# EAGLE design Ctrl_AVR_Reg (EAGLE 5.11)
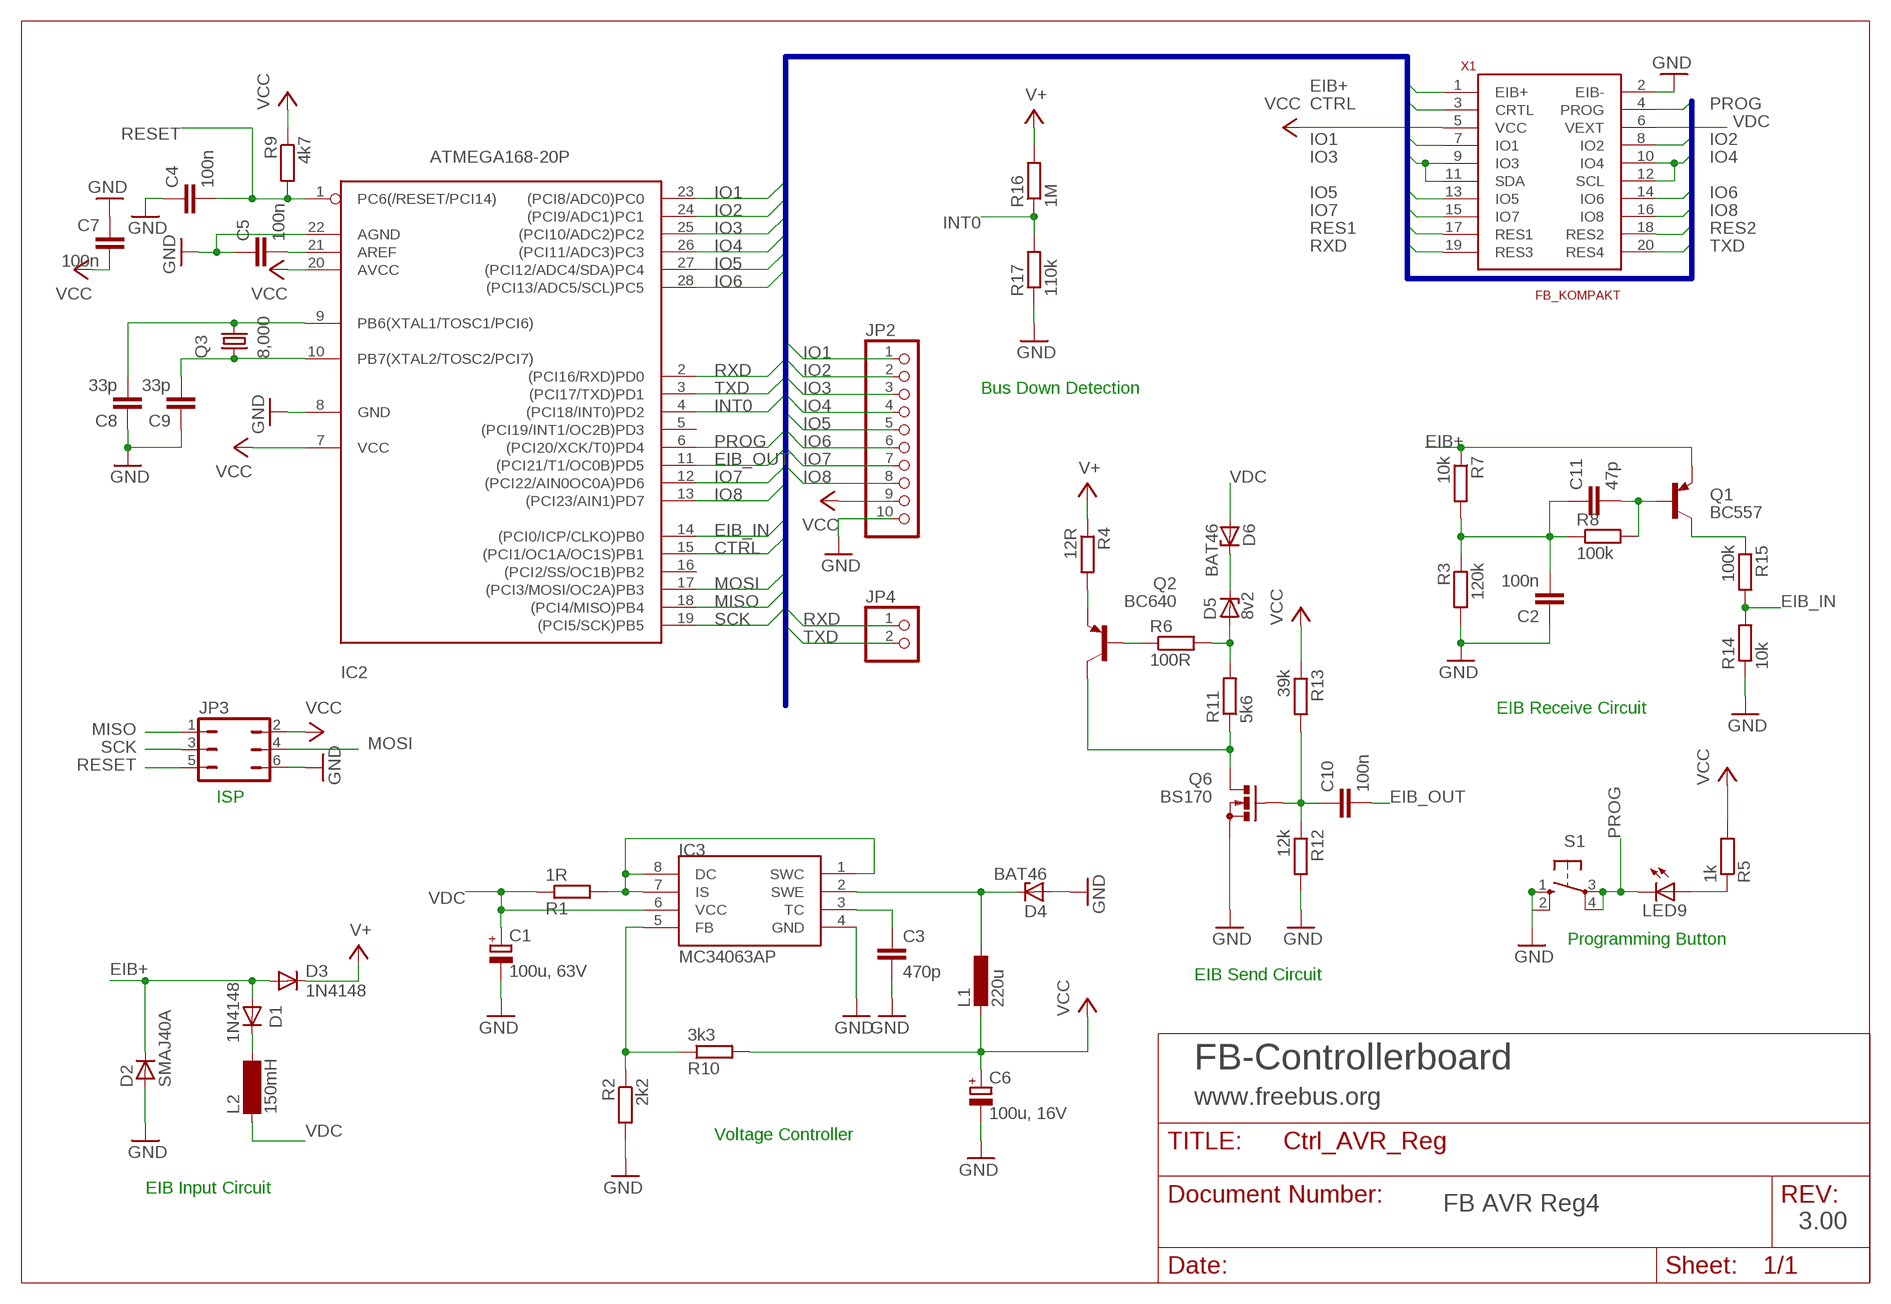
[diagram p0: schematic, sheet 1]

## Parts
C1  100u, 63V  CPOL-EUE5-10.5  [E5-10,5]
C2  100n  C-EU050-024X044  [C050-024X044]
C3  470p  C-EU025-024X044  [C025-024X044]
C4  100n  C-EU050-024X044  [C050-024X044]
C5  100n  C-EUC1206  [C1206]
C6  100u, 16V  CPOL-EUE2.5-7  [E2,5-7]
C7  100n  C-EUC1206  [C1206]
C8  33p  C-EU025-025X050  [C025-025X050]
C9  33p  C-EU025-025X050  [C025-025X050]
C10  100n  C-EU050-024X044  [C050-024X044]
C11  47p  C-EU050-024X044  [C050-024X044]
D1  1N4148  1N4148DO35-10  [DO35-10]
D2  SMAJ40A  D-SMB  [SMB]
D3  1N4148  1N4148DO35-10  [DO35-10]
D4  BAT46  1N821  [DO35Z10]
D5  8v2  BZX90  [DO34Z7]
D6  BAT46  1N821  [DO35Z10]
IC2  ATMEGA168-20P  [DIL28-3]
IC3  MC34063AP  [DIL08]
JP2  PINHD-1X10  [1X10]
JP3  JP3Q  [JP3Q]
JP4  PINHD-1X2  [1X02]
L1  220u  L-EU0207/12  [0207/12]
L2  150mH  SD12-1000  [SD12_1000]
LED9  LED3MM  [LED3MM]
Q1  BC557  [TO92]
Q2  BC640  [TO92-BCE]
Q3  8,000  CRYSTALHC49U-V  [HC49U-V]
Q6  BS170  [SOT54E]
R1  1R  R-EU_0207/10  [0207/10]
R2  2k2  R-EU_0207/10  [0207/10]
R3  120k  R-EU_0207/10  [0207/10]
R4  12R  R-EU_0207/10  [0207/10]
R5  1k  R-EU_0207/10  [0207/10]
R6  100R  R-EU_0207/10  [0207/10]
R7  10k  R-EU_0207/10  [0207/10]
R8  100k  R-EU_0207/10  [0207/10]
R9  4k7  R-EU_0207/10  [0207/10]
R10  3k3  R-EU_0207/10  [0207/10]
R11  5k6  R-EU_0207/10  [0207/10]
R12  12k  R-EU_0207/10  [0207/10]
R13  39k  R-EU_0207/10  [0207/10]
R14  10k  R-EU_0207/10  [0207/10]
R15  100k  R-EU_0207/10  [0207/10]
R16  1M  R-EU_0207/10  [0207/10]
R17  110k  R-EU_0207/10  [0207/10]
S1  10-XX  [B3F-10XX]
X1  FB_KOMPAKT  [ML20]

## Nets
CTRL: IC2.15((PCI1/OC1A/OC1S)PB1) X1.3(CRTL)
EIB+: D1.A D2.1(C) D3.A Q1.1(E) R7.1 X1.1(EIB+)
EIB_IN: IC2.14((PCI0/ICP/CLKO)PB0) R14.2 R15.2
EIB_OUT: C10.2 IC2.11((PCI21/T1/OC0B)PD5)
GND: C1.- C2.1 C3.2 C4.1 C5.1 C6.- C7.1 C8.1 C9.1 D2.2(A) D4.A IC2.8(GND) IC2.22(AGND) IC3.4(GND) JP2.10 JP3.6 Q6.S R2.2 R3.2 R12.2 R14.1 R17.1 S1.1(S) S1.2(S1) X1.2(EIB-)
INT0: IC2.4((PCI18/INT0)PD2) R16.1 R17.2
IO1: IC2.23((PCI8/ADC0)PC0) JP2.1 X1.7(IO1)
IO2: IC2.24((PCI9/ADC1)PC1) JP2.2 X1.8(IO2)
IO3: IC2.25((PCI10/ADC2)PC2) JP2.3 X1.9(IO3) X1.11(SDA)
IO4: IC2.26((PCI11/ADC3)PC3) JP2.4 X1.10(IO4) X1.12(SCL)
IO5: IC2.27((PCI12/ADC4/SDA)PC4) JP2.5 X1.13(IO5)
IO6: IC2.28((PCI13/ADC5/SCL)PC5) JP2.6 X1.14(IO6)
IO7: IC2.12((PCI22/AIN0OC0A)PD6) JP2.7 X1.15(IO7)
IO8: IC2.13((PCI23/AIN1)PD7) JP2.8 X1.16(IO8)
MISO: IC2.18((PCI4/MISO)PB4) JP3.1
MOSI: IC2.17((PCI3/MOSI/OC2A)PB3) JP3.4
N$1: Q2.E R4.2
N$2: D5.C D6.C
N$3: C10.1 Q6.G R12.1 R13.2
N$4: Q2.B R6.1
N$5: Q2.C Q6.D R11.1
N$6: D1.C L2.2
N$7: C2.2 C11.1 R3.1 R7.2 R8.1
N$8: C8.2 IC2.9(PB6(XTAL1/TOSC1/PCI6)) Q3.2
N$9: C9.2 IC2.10(PB7(XTAL2/TOSC2/PCI7)) Q3.1
N$10: D5.A R6.2 R11.2
N$12: IC3.1(SWC) IC3.7(IS) IC3.8(DC) R1.2
N$19: LED9.A R5.1
N$20: D4.C IC3.2(SWE) L1.1
N$21: C3.1 IC3.3(TC)
N$22: IC3.5(FB) R2.1 R10.1
N$24: C5.2 IC2.21(AREF)
N$26: C11.2 Q1.2(B) R8.2
N$28: Q1.3(C) R15.1
PROG: IC2.6((PCI20/XCK/T0)PD4) LED9.K(C) S1.3(P) S1.4(P1) X1.4(PROG)
RES1: X1.17(RES1)
RES2: X1.18(RES2)
RESET: C4.2 IC2.1(PC6(/RESET/PCI14)) JP3.5 R9.2
RXD: IC2.2((PCI16/RXD)PD0) JP4.1 X1.19(RES3)
SCK: IC2.19((PCI5/SCK)PB5) JP3.3
TXD: IC2.3((PCI17/TXD)PD1) JP4.2 X1.20(RES4)
V+: D3.C R4.1 R16.2
VCC: C6.+ C7.2 IC2.7(VCC) IC2.20(AVCC) JP2.9 JP3.2 L1.2 R5.2 R9.1 R10.2 R13.1 X1.5(VCC)
VDC [supply]: C1.+ D6.A IC3.6(VCC) L2.1 R1.1 X1.6(VEXT)
Unconnected: IC2.5((PCI19/INT1/OC2B)PD3) IC2.16((PCI2/SS/OC1B)PB2)

## Buses
IO1,IO2,IO3,IO4,IO5,IO6,IO7,IO8,RXD,TXD,MOSI,PROG,MISO,EIB+,SCK,EIB_IN,EIB_OUT,CTRL,INT0,INT1,RES1,RES2

## Notes on the sheet
- Bus Down Detection
- EIB Receive Circuit
- ISP
- Programming Button
- EIB Send Circuit
- FB-Controllerboard
- www.freebus.org
- Voltage Controller
- EIB Input Circuit
- FB AVR Reg4
- 3.00

## Library data of the parts
C1 C6 = rcl:CPOL-EU: POLARIZED CAPACITOR, European symbol
C2-C5 C7-C11 = rcl:C-EU: CAPACITOR, European symbol
D1 D3 = diode:1N4148: DIODE high speed (Philips)
D2 = semicon-smd-ipc:D-: DIODE unfilled
D4 D6 = diode:1N821: Reference DIODE temperature compensated, 6,2 V
D5 = diode:BZX90: Z DIODE
IC2 = avr:ATMEGA168*P: MICROCONTROLLER 16 kBytes FLASH 1 kBytes SRAM 512 Bytes EEPROM USART 8-channel 10 bit ADC
IC3 = mc34063:MC34063
JP2 = pinhead:PINHD-1X10: PIN HEADER
JP3 = jumper:JP3Q: JUMPER
JP4 = pinhead:PINHD-1X2: PIN HEADER
L1 = rcl:L-EU: INDUCTOR, European symbol
L2 = inductor-neosid:SD12: INDUCTOR nominal inductance; OC_FARNELL: unknown; OC_NEWARK: unknown
LED9 = led:LED: LED OSRAM: - CHIPLED LG R971, LG N971, LY N971, LG Q971, LY Q971, LO R971, LY R971 LH N974, LH R974 LS Q976, LO Q976, LY Q976 LO Q996 - Hyper CHIPLED LW Q18S LB Q993, LB Q99A, LB R99A - SideLED LS A670, LO A670, LY A670, LG A670, LP A670 LB A673, LV A673, LT A673, LW A673 LH A674 LY A675 LS A676, LA A676, LO A676, LY A676, LW A676 LS A679, LY A679, LG A679 - Hyper Micro SIDELED® LS Y876, LA Y876, LO Y876, LY Y876 LT Y87S - SmartLED LW L88C, LW L88S LB L89C, LB L89S, LG L890 LS L89K, LO L89K, LY L89K LS L896, LA L896, LO L896, LY L896 - TOPLED LS T670, LO T670, LY T670, LG T670, LP T670 LSG T670, LSP T670, LSY T670, LOP T670, LYG T670 LG T671, LOG T671, LSG T671 LB T673, LV T673, LT T673, LW T673 LH T674 LS T676, LA T676, LO T676, LY T676, LB T676, LH T676, LSB T676, LW T676 LB T67C, LV T67C, LT T67C, LS T67K, LO T67K, LY T67K, LW E67C LS E67B, LA E67B, LO E67B, LY E67B, LB E67C, LV E67C, LT E67C LW T67C LS T679, LY T679, LG T679 LS T770, LO T770, LY T770, LG T770, LP T770 LB T773, LV T773, LT T773, LW T773 LH T774 LS E675, LA E675, LY E675, LS T675 LS T776, LA T776, LO T776, LY T776, LB T776 LHGB T686 LT T68C, LB T68C - Hyper Mini TOPLED® LB M676 - Mini TOPLED Santana® LG M470 LS M47K, LO M47K, LY M47K Source: http://www.osram.convergy.de LUXEON: - LUMILED® LXK2-PW12-R00, LXK2-PW12-S00, LXK2-PW14-U00, LXK2-PW14-V00 LXK2-PM12-R00, LXK2-PM12-S00, LXK2-PM14-U00 LXK2-PE12-Q00, LXK2-PE12-R00, LXK2-PE12-S00, LXK2-PE14-T00, LXK2-PE14-U00 LXK2-PB12-K00, LXK2-PB12-L00, LXK2-PB12-M00, LXK2-PB14-N00, LXK2-PB14-P00, LXK2-PB14-Q00 LXK2-PR12-L00, LXK2-PR12-M00, LXK2-PR14-Q00, LXK2-PR14-R00 LXK2-PD12-Q00, LXK2-PD12-R00, LXK2-PD12-S00 LXK2-PH12-R00, LXK2-PH12-S00 LXK2-PL12-P00, LXK2-PL12-Q00, LXK2-PL12-R00 Source: www.luxeon.com KINGBRIGHT: KA-3528ASYC Source: www.kingbright.com
Q1 = transistor-pnp:BC557: PNP Transistor
Q2 = transistor-pnp:BC640*: PNP Transistror
Q3 = crystal:CRYSTAL: CRYSTAL
Q6 = transistor-small-signal:BS170: N-CHANNEL MOS FET
R1-R17 = rcl:R-EU_: RESISTOR, European symbol
S1 = switch-omron:10-XX: OMRON SWITCH; MPN: B3F-1000; OC_FARNELL: 176432; OC_NEWARK: 36M3542
X1 = EIB_Freebus:FB_KOMPAKT: Steckverbinder für Controller <--> Anwendung Kompaktversion Vorteile: - Das Symbol im Schaltplan sieht so aus wie auf dem PCB - Vielleicht schneller zu überblicken, was an welchem Pin angeschlossen ist Nachteile: - Viele unnötige Leitungen im Schaltplan notwendig

## Net classes
0 default: width 0.406 mm
1 supply: width 0.406 mm

## Board
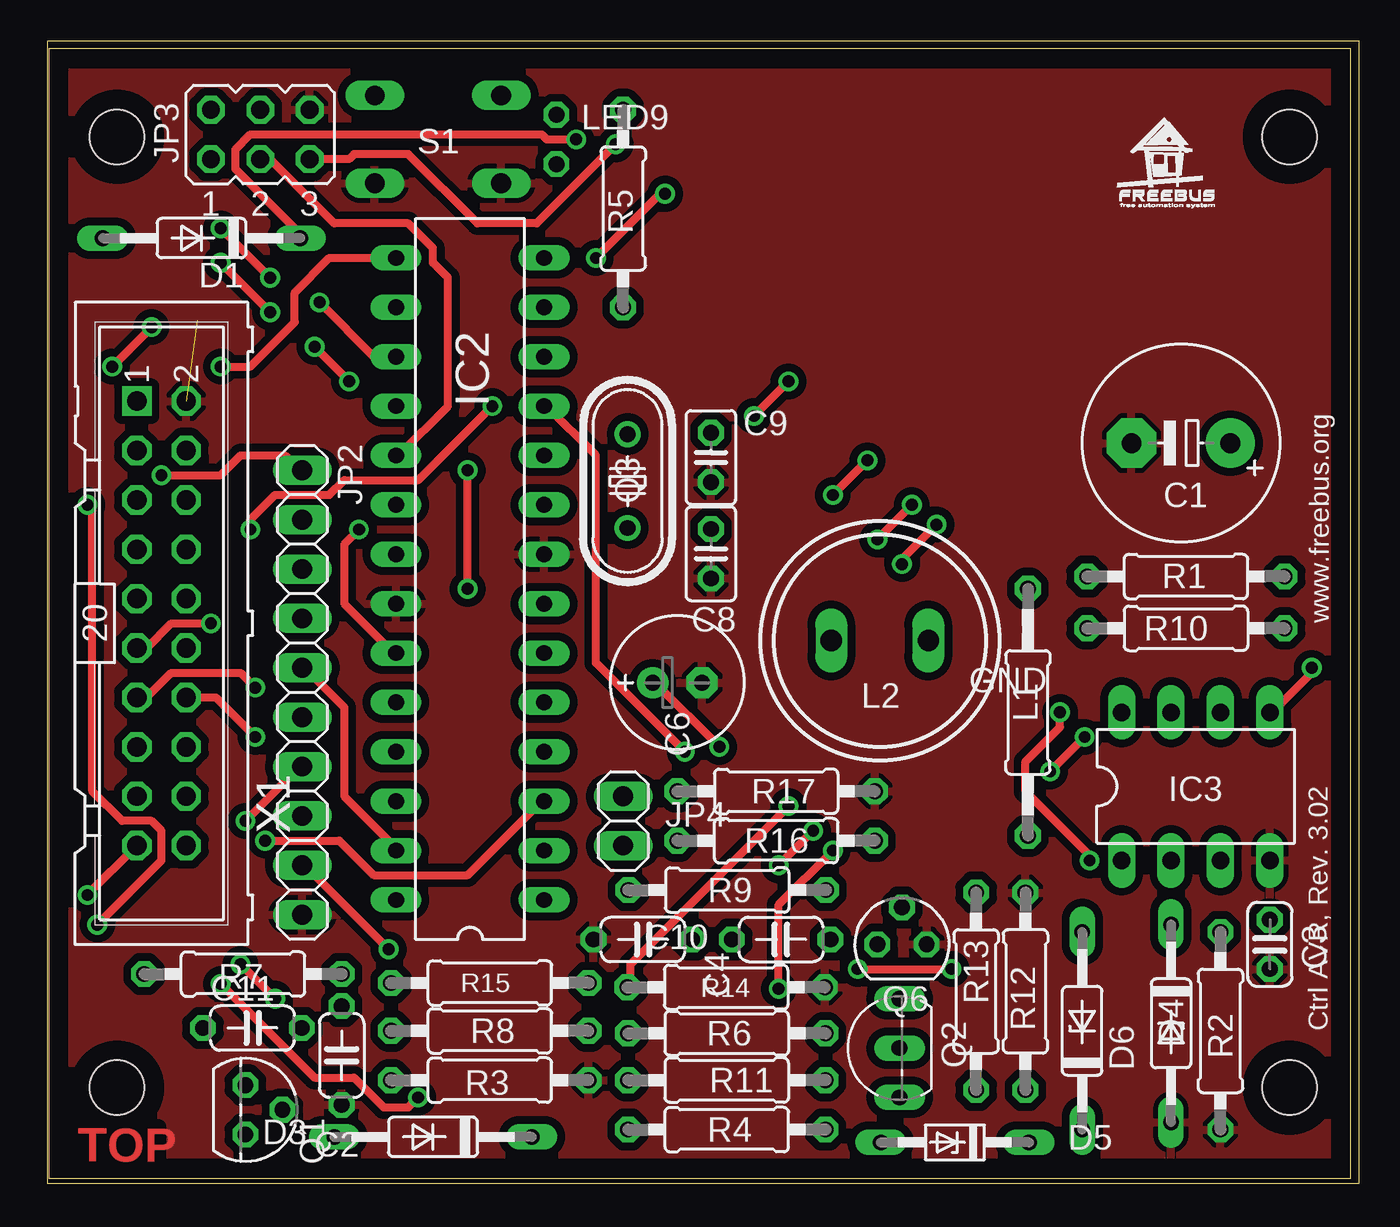
[diagram p1: board, top side]
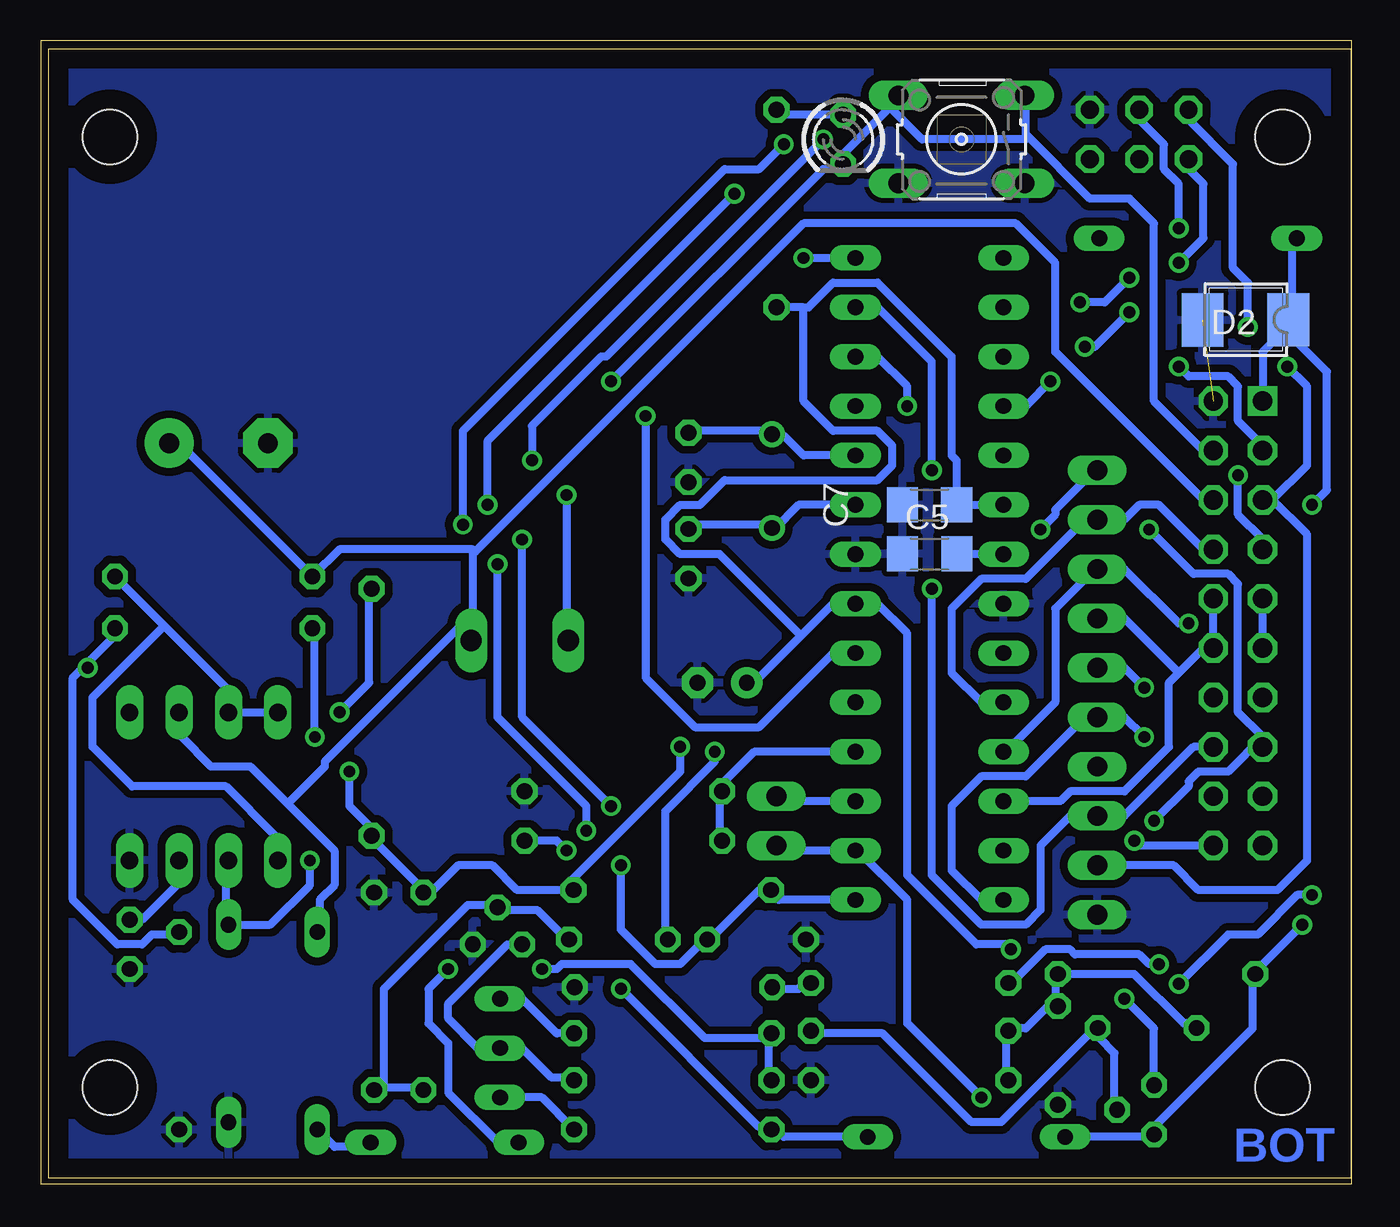
[diagram p2: board, bottom side, seen from below]

Size 67.01 x 58.1 mm. Coordinates in mm from the lower left corner, seen from the top.
Outline: 0,58.1 0,0 67.01,0 67.01,58.1 0,58.1
Copper layers (1*16): Top 0.035mm / dielectric 1.5mm / Bottom 0.035mm
Design rules "idefix-default *": minimum track width 10mil, minimum drill 24mil, track to track 16mil, track to pad 12mil, pad to pad 16mil, via to via 16mil, smd to smd 16mil, copper to edge 40mil, drill to drill 8mil, minimum pad ring 10mil, minimum via ring 8mil, stop-mask expansion 4mil, vias tented up to drill 0mil, thermal gap 10mil
Holes 2.8 mm at 3.52,53.55 63.85,4.66 63.85,53.55 3.52,4.66
Milling: 4 lines

### Footprints (pad centres in the part's own frame; a part is rotated, then mirrored left to right if it is on the bottom)
E5-10,5 = drill 1.016 pad 2.54 round: + -2.54,0 | drill 1.016 pad 2.54 octagon: - 2.54,0
C050-024X044 = drill 0.813 octagon: 1 -2.54,0; 2 2.54,0
C025-024X044 = drill 0.813 octagon: 1 -1.27,0; 2 1.27,0
C1206 = smd 1.6 x 1.8: 1 -1.4,0; 2 1.4,0
E2,5-7 = drill 0.813 pad 1.6 round: + -1.27,0 | drill 0.813 pad 1.6 octagon: - 1.27,0
C025-025X050 = drill 0.813 octagon: 1 -1.27,0; 2 1.27,0
DO35-10 = drill 0.813 long: A 5.08,0; C -5.08,0
SMB = smd 2.159 x 2.743: 1 -2.311,-0.127; 2 2.108,-0.102
DO35Z10 = drill 0.813 long: A 5.08,0; C -5.08,0
DO34Z7 = drill 0.813 long: A 3.81,0; C -3.81,0
DIL28-3 = drill 0.813 long: 1 -16.51,-3.81; 2 -13.97,-3.81; 3 -11.43,-3.81; 4 -8.89,-3.81; 5 -6.35,-3.81; 6 -3.81,-3.81; 7 -1.27,-3.81; 8 1.27,-3.81; 9 3.81,-3.81; 10 6.35,-3.81; 11 8.89,-3.81; 12 11.43,-3.81; 13 13.97,-3.81; 14 16.51,-3.81; 15 16.51,3.81; 16 13.97,3.81; 17 11.43,3.81; 18 8.89,3.81; 19 6.35,3.81; 20 3.81,3.81; 21 1.27,3.81; 22 -1.27,3.81; 23 -3.81,3.81; 24 -6.35,3.81; 25 -8.89,3.81; 26 -11.43,3.81; 27 -13.97,3.81; 28 -16.51,3.81
DIL08 = drill 0.9 long: 1 -3.81,-3.81; 2 -1.27,-3.81; 3 1.27,-3.81; 4 3.81,-3.81; 5 3.81,3.81; 6 1.27,3.81; 7 -1.27,3.81; 8 -3.81,3.81
1X10 = drill 1.016 long: 1 -11.43,0; 2 -8.89,0; 3 -6.35,0; 4 -3.81,0; 5 -1.27,0; 6 1.27,0; 7 3.81,0; 8 6.35,0; 9 8.89,0; 10 11.43,0
JP3Q = drill 0.914 octagon: 1 -2.54,-1.27; 2 -2.54,1.27; 3 0,-1.27; 4 0,1.27; 5 2.54,-1.27; 6 2.54,1.27
1X02 = drill 1.016 long: 1 -1.27,0; 2 1.27,0
0207/12 = drill 0.813 octagon: 1 -6.35,0; 2 6.35,0
SD12_1000 = drill 1.1 long: 1 -2.5,0; 2 2.5,0
LED3MM = drill 0.813 octagon: A -1.27,0; K 1.27,0
TO92 = drill 0.813 octagon: 1 1.27,0; 2 0,1.905; 3 -1.27,0
TO92-BCE = drill 0.813 long: B 2.54,0; C 0,0; E -2.54,0
HC49U-V = drill 0.813 round: 1 -2.413,0; 2 2.413,0
SOT54E = drill 0.813 octagon: D -1.27,0; G 0,1.905; S 1.27,0
0207/10 = drill 0.813 octagon: 1 -5.08,0; 2 5.08,0
B3F-10XX = drill 1.016 long: 1 -3.251,2.261; 2 3.251,2.261; 3 -3.251,-2.261; 4 3.251,-2.261
ML20 = drill 1 square: 1 -11.43,-1.27 | drill 1 octagon: 2 -11.43,1.27; 3 -8.89,-1.27; 4 -8.89,1.27; 5 -6.35,-1.27; 6 -6.35,1.27; 7 -3.81,-1.27; 8 -3.81,1.27; 9 -1.27,-1.27; 10 -1.27,1.27; 11 1.27,-1.27; 12 1.27,1.27; 13 3.81,-1.27; 14 3.81,1.27; 15 6.35,-1.27; 16 6.35,1.27; 17 8.89,-1.27; 18 8.89,1.27; 19 11.43,-1.27; 20 11.43,1.27

### Placement (x,y rotation side)
C1  58.26,37.81 180 top
C2  15.08,6.31 90 top
C3  62.83,12.03 270 top
C4  30.58,12.28 0 top
C5  21.68,32.11 0 bottom
C6  32.35,25.49 0 top
C7  21.69,34.63 0 bottom
C8  34.08,32.12 90 top
C9  34.08,37.07 90 top
C10  37.69,12.28 180 top
C11  10.49,7.73 0 top
D1  7.87,48.35 180 top
D2  5.52,44.03 180 bottom
D3  19.78,2.12 180 top
D4  57.75,7.96 270 top
D5  46.63,1.84 180 top
D6  53.18,7.58 90 top
IC2  21.69,30.82 90 top
IC3  59.02,20.15 0 top
JP2  13.05,24.98 270 top
JP3  10.89,53.68 0 top
JP4  29.56,18.38 90 top
L1  50.39,23.96 270 top
L2  42.77,27.65 180 top
LED9  26.13,53.43 270 bottom
Q1  10.13,3.52 270 top
Q2  43.78,6.69 90 top
Q3  29.79,35.85 270 top
Q6  43.91,12.03 0 top
R1  58.52,30.95 0 top
R2  60.29,7.58 270 top
R3  22.7,5.04 0 top
R4  34.89,2.5 0 top
R5  29.56,49.87 270 top
R6  34.89,7.45 180 top
R7  10,10.5 0 top
R8  22.7,7.58 0 top
R9  34.92,14.82 180 top
R10  58.52,28.28 180 top
R11  34.89,5.04 180 top
R12  50.26,9.61 90 top
R13  47.72,9.61 270 top
R14  34.86,9.82 180 top
R15  22.7,10.04 0 top
R16  37.43,17.36 0 top
R17  37.43,19.9 180 top
S1  20.03,53.43 180 bottom
X1  5.81,28.54 270 top

### Tracks (layer width: path | path; a pad name or v marks a point on that pad's centre or on a via)
CTRL  (via drill 0.61)
  Top 0.406: v8.86,41.74 10.38,41.74 12.67,44.03 12.67,45.55 14.45,47.33 IC2.15
  Bottom 0.406: v8.86,41.74 8.35,41.24 6.32,41.24 5.81,40.73 5.81,38.95 4.54,37.68 X1.3
EIB+  (via drill 0.61)
  Top 0.406: v2,34.63 2.25,34.38 2.25,19.9 3.78,18.38 5.3,18.38 5.81,17.87 5.81,16.34 v2.51,13.04
  Bottom 0.406: D1.A 3.02,48.35 3.02,44.28 D2.1 | X1.1 4.54,42.51 3.02,44.03 D2.1 | 10.64,2.12 10.13,2.12 Q1.1 10.64,2.12 | 10.64,2.12 D3.A | 5.05,10.5 5.05,7.71 10.64,2.12 | v2,34.63 1.24,35.39 1.24,41.49 3.27,43.52 D2.1 | 5.05,10.5 v2.51,13.04 | 5.05,10.5 R7.1
EIB_IN  (via drill 0.61)
  Top 0.406: v28.16,47.33 31.46,50.63 v31.72,50.63 | v42.64,32.85 v44.42,34.63 | v38.07,19.14 29.94,11.01 29.94,9.99 R14.2
  Bottom 0.406: R14.2 29.69,9.74 28.42,9.74 27.91,10.25 R15.2 | v31.72,50.63 44.42,37.93 v44.42,34.63 | v42.64,32.85 42.64,23.71 v38.07,19.14 | v28.16,47.33 IC2.14
EIB_OUT  (via drill 0.61)
  Top 0.406: v32.73,21.93 28.16,26.5 28.16,37.17 25.62,39.71 IC2.11
  Bottom 0.406: v32.73,21.93 32.73,21.42 35.27,18.88 35.27,12.28 C10.2
GND  (1 unrouted)
  pour Top: 0.22,58 0.22,-0.17 57.46,-0.2 57.39,-0.16 67.15,-0.23 67.28,24.09 67.28,58
  pour Bottom: 0.27,58 67.18,58 67.18,0.14 16.92,-0.06 9.78,-0.12 0.27,-0.12
INT0
  Bottom 0.406: IC2.4 30.7,21.93 32.23,20.41 32.23,19.9 R17.2 32.48,19.9 32.48,17.36 R16.1
IO1  (via drill 0.61)
  Top 0.406: v15.97,33.36 15.21,32.6 15.21,29.55 17.75,27.01 IC2.23 | v5.81,36.16 8.86,36.16 9.87,37.17 12.16,37.17 12.92,36.41 JP2.1
  Bottom 0.406: v15.97,33.36 15.21,34.12 15.21,34.38 13.18,36.41 JP2.1 | X1.7 4.54,32.85 5.81,34.12 v5.81,36.16
IO2
  Bottom 0.406: IC2.24 19.02,24.47 20.54,26 20.54,29.3 19.02,30.82 16.73,30.82 13.68,33.87 JP2.2 11.65,33.87 10.89,34.63 9.87,34.63 7.59,32.35 X1.8
IO3  (via drill 0.61)
  Top 0.406: X1.11 5.05,27.27 6.32,28.54 v8.35,28.54
  Bottom 0.406: X1.11 X1.9 | IC2.25 17.75,21.93 15.21,24.47 15.21,29.3 13.18,31.33 JP2.3 11.65,31.33 8.86,28.54 v8.35,28.54
IO4
  Bottom 0.406: 8.86,26 7.59,27.27 X1.12 X1.10 | 8.86,26 9.37,25.49 9.37,22.19 11.65,19.9 14.45,19.9 14.95,19.39 IC2.26 | 8.86,26 11.65,28.79 JP2.4
IO5  (via drill 0.61)
  Top 0.406: IC2.27 17.75,16.85 17.75,17.11 15.21,19.65 15.21,24.22 13.18,26.25 JP2.5 | X1.13 5.05,24.73 6.32,26 9.87,26 v10.64,25.23
  Bottom 0.406: v10.64,25.23 11.65,26.25 JP2.5
IO6  (via drill 0.61)
  Top 0.406: X1.14 8.6,24.73 v10.64,22.69
  Bottom 0.406: IC2.28 19.02,14.31 20.54,15.84 20.54,19.14 19.02,20.66 16.73,20.66 13.68,23.71 JP2.6 11.65,23.71 v10.64,22.69
IO7  (via drill 0.61)
  Top 0.406: v22.83,39.71 19.02,35.9 15.21,35.9 14.45,35.14 11.65,35.14 10.38,33.87 v10.38,33.36 | v10.13,18.38 12.92,21.17 JP2.7
  Bottom 0.406: v22.83,39.71 22.83,40.73 24.35,42.25 IC2.12 | v10.38,33.36 8.1,31.08 6.32,31.08 5.81,30.57 5.81,23.96 4.54,22.69 | v10.13,18.38 8.35,20.15 8.35,20.41 7.84,20.92 6.32,20.92 4.54,22.69 | X1.15 4.54,22.69
IO8  (via drill 0.61)
  Top 0.406: v21.56,30.31 v21.56,36.41
  Bottom 0.406: v21.56,36.41 21.56,42 24.35,44.79 IC2.13 | v21.56,30.31 21.56,15.58 19.02,13.04 16.73,13.04 15.97,13.8 15.97,17.11 14.45,18.63 JP2.8 11.65,18.63 8.1,22.19 X1.16
MISO  (via drill 0.61)
  Top 0.406: v13.68,42.76 v15.46,40.98 | v8.86,47.08 v11.4,44.54
  Bottom 0.406: v15.46,40.98 16.73,39.71 IC2.18 | v13.68,42.76 13.18,42.76 v11.4,44.54 | v8.86,47.08 7.59,48.35 7.59,51.14 8.35,51.9 JP3.1
MOSI  (via drill 0.61)
  Top 0.406: v13.94,45.05 16.73,42.25 IC2.17 | v8.86,48.86 v11.4,46.32
  Bottom 0.406: v13.94,45.05 12.67,45.05 v11.4,46.32 | v8.86,48.86 8.86,51.14 9.62,51.9 9.62,53.17 10.89,54.44 JP3.4
N$1
  Bottom 0.406: R4.2 41.62,4.15 Q2.E
N$2
  Bottom 0.406: D5.C 50.51,1.61 52.29,1.61 D6.C
N$3
  Bottom 0.406: 49.75,4.66 50.26,4.66 R12.1 49.75,4.66 | 49.75,4.66 47.72,4.66 R13.2 | C10.1 40.35,12.28 41.88,13.8 43.91,13.8 Q6.G 43.91,14.06 45.43,14.06 49.75,9.74 49.75,4.66
N$4
  Bottom 0.406: R6.1 40.86,7.45 42.64,9.23 Q2.B
N$5
  Bottom 0.406: R11.1 40.1,5.17 41.12,5.17 42.64,6.69 Q2.C 44.93,6.69 46.45,8.22 46.45,8.98 43.4,12.03 Q6.D
N$6  (via drill 0.61)
  Top 0.406: v27.15,53.43 25.62,53.43 25.37,53.68 10.38,53.68 9.62,52.92 9.62,51.9 12.92,48.6 12.92,48.35 D1.C | v42.13,36.92 v40.35,35.14
  Bottom 0.406: v27.15,53.43 38.32,42.25 38.58,42.25 42.13,38.7 v42.13,36.92 | v40.35,35.14 40.35,27.77 L2.2
N$7
  Bottom 0.406: R3.1 17.75,5.17 17.75,7.45 R8.1 17.49,7.71 16.73,7.71 15.21,9.23 | C11.1 8.1,7.96 8.6,7.96 11.14,10.5 R7.2 15.21,10.5 15.21,9.23 | 15.21,9.23 15.21,8.98 C2.2 15.21,9.23
N$8
  Bottom 0.406: IC2.9 28.42,34.63 29.69,33.36 Q3.2 29.94,33.62 34,33.62 C8.2
N$9
  Bottom 0.406: IC2.10 28.16,37.17 29.18,38.19 29.69,38.19 Q3.1 29.94,38.44 34,38.44 C9.2
N$10  (via drill 0.61)
  Top 0.406: v41.62,10.76 v46.45,10.76
  Bottom 0.406: 29.94,7.2 29.94,7.45 R6.2 29.94,7.2 | 29.94,7.2 29.94,5.17 R11.2 | v46.45,10.76 47.47,9.74 47.47,7.96 46.45,6.95 46.45,4.41 43.91,1.87 42.89,1.87 D5.A | v41.62,10.76 40.86,10.76 40.61,11.01 37.05,11.01 33.24,7.2 29.94,7.2
N$12
  Bottom 0.406: 61.06,28.41 57.88,25.23 57.88,23.96 IC3.7 IC3.8 | 61.06,28.41 R1.2 | IC3.1 55.34,16.34 55.34,17.61 57.88,20.15 62.71,20.15 64.74,22.19 64.74,24.73 61.06,28.41
N$19
  Bottom 0.406: LED9.A 29.43,54.7 29.69,54.95 R5.1
N$20  (via drill 0.61)
  Top 0.406: v52.04,23.96 52.04,23.2 50.26,21.42 50.26,19.9 53.56,16.6 v53.56,16.34
  Bottom 0.406: IC3.2 57.88,16.34 57.88,13.04 D4.C 55.59,13.04 53.56,15.07 v53.56,16.34 | v52.04,23.96 50.51,25.49 50.51,30.31 L1.1
N$21
  Bottom 0.406: C3.1 62.2,13.3 60.42,15.07 60.42,16.34 IC3.3
N$22  (via drill 0.61)
  Top 0.406: v64.99,26.25 64.99,26 62.96,23.96 IC3.5
  Bottom 0.406: 65.12,26.38 63.72,27.77 63.72,28.28 R10.1 | 65.12,26.38 65.75,25.74 65.75,14.31 63.47,12.03 62.2,12.03 61.69,12.53 60.42,12.53 R2.1 | 65.12,26.38 v64.99,26.25
N$24
  Bottom 0.406: C5.2 20.03,32.09 IC2.21
N$26
  Bottom 0.406: Q1.2 12.16,3.64 12.16,6.44 12.92,7.2 12.92,7.71 C11.2 13.18,7.71 18,2.88 19.53,2.88 24.1,7.45 27.65,7.45 R8.2
N$28  (via drill 0.61)
  Top 0.406: v11.65,9.23 v9.87,11.01
  Bottom 0.406: v11.65,9.23 10.13,7.71 Q1.3 | v9.87,11.01 10.38,11.01 10.89,11.52 14.19,11.52 14.45,11.77 15.72,11.77 17.49,9.99 R15.1
PROG  (via drill 0.61)
  Top 0.406: v38.07,40.98 v36.29,39.2
  Bottom 0.406: X1.4 7.59,37.43 10.13,39.97 10.13,49.11 11.4,50.38 13.43,50.38 16.61,53.55 | 16.61,53.55 16.73,53.68 16.73,55.46 S1.3 | v36.29,39.2 36.29,25.74 33.75,23.2 30.45,23.2 26.64,27.01 IC2.6 | v38.07,40.98 27.15,51.9 26.38,51.9 LED9.K 26.13,52.67 23.34,55.46 S1.4 23.59,54.95 22.07,53.43 16.73,53.43 16.61,53.55
RESET  (via drill 0.61)
  Top 0.406: JP3.5 15.46,52.41 15.72,52.67 18.51,52.67 22.07,49.11 25.11,49.11 v29.18,53.17 | v45.69,33.62 43.91,31.84 v43.91,31.58 | v37.56,16.09 v39.34,17.87
  Bottom 0.406: 29.94,14.82 29.43,14.31 IC2.1 | 29.94,14.82 30.45,14.82 32.99,12.28 C4.2 33.24,12.28 34.51,11.01 35.78,11.01 37.56,12.79 v37.56,16.09 | 29.94,14.82 R9.2 | v29.18,53.17 30.45,51.9 32.23,51.9 45.69,38.44 v45.69,33.62 | v43.91,31.58 43.91,23.71 39.34,19.14 v39.34,17.87
RXD  (via drill 0.61)
  Top 0.406: v2,14.57 X1.19 | v8.86,9.99 13.68,5.17 15.72,5.17 17.24,3.64 18.51,3.64 v19.02,4.15
  Bottom 0.406: JP4.1 29.43,17.11 29.18,16.85 IC2.2 25.37,16.85 22.83,14.31 22.83,7.96 v19.02,4.15 | v2,14.57 2.76,14.57 4.79,12.53 6.32,12.53 v8.86,9.99
SCK
  Top 0.406: JP3.3 11.4,52.41 14.7,49.11 18.51,49.11 19.78,47.84 19.78,47.08 20.54,46.32 20.54,39.71 18,37.17 IC2.19
TXD  (via drill 0.61)
  Top 0.406: v11.14,17.36 14.95,17.36 16.73,15.58 21.56,15.58 25.37,19.39 IC2.3
  Bottom 0.406: IC2.3 29.18,19.39 29.43,19.65 JP4.2 | X1.20 10.89,17.11 v11.14,17.36
V+  (via drill 0.61)
  Top 0.406: v40.35,16.85 37.56,14.06 v37.56,9.74
  Bottom 0.406: D3.C 29.18,2.12 29.69,2.63 R4.1 29.94,2.63 30.45,2.63 v37.56,9.74 | v40.35,16.85 40.86,17.36 R16.2
VCC  (via drill 0.61)
  Top 0.406: v3.27,41.74 v5.3,43.78 | v51.53,20.92 v53.31,22.69 | v34.51,22.19 31.21,25.49 C6.+ | v17.49,11.77 13.18,16.09 JP2.9
  Bottom 0.406: JP3.2 8.35,54.44 6.06,52.16 6.06,46.82 5.3,46.06 v5.3,43.78 | v3.27,41.74 2.25,40.73 2.25,36.66 4.03,34.89 | 4.03,34.89 2.25,33.11 2.25,16.34 3.78,14.82 7.84,14.82 9.11,16.09 JP2.9 | 4.03,34.89 X1.5 | IC2.20 C7.2 20.29,36.92 20.54,37.17 20.54,42.25 24.35,46.06 26.64,46.06 27.91,44.79 28.16,44.79 | 28.16,44.79 R5.2 | 28.29,27.9 30.7,25.49 C6.+ | 28.29,27.9 26.64,29.55 IC2.7 24.35,29.55 22.83,28.03 22.83,15.58 19.27,12.03 17.75,12.03 v17.49,11.77 | 47.72,14.82 50.51,17.61 | 40.1,14.82 42.89,14.82 44.16,16.09 45.94,16.09 47.21,14.82 47.72,14.82 | 47.72,14.82 R13.1 | v53.31,22.69 53.31,28.28 R10.2 | v51.53,20.92 51.53,19.14 50.51,18.12 50.51,17.61 | 50.51,17.61 L1.2 | v34.51,22.19 34.51,20.92 40.1,15.33 40.1,14.82 | 40.1,14.82 R9.1 | 28.16,44.79 28.16,39.97 26.64,38.44 24.35,38.44 23.59,37.68 23.59,36.66 24.35,35.9 32.23,35.9 33.5,34.63 34.51,34.63 35.27,33.87 35.27,32.85 34.51,32.09 32.48,32.09 28.29,27.9
VDC
  Bottom 0.406: 54.71,19.26 56.61,21.17 58.64,21.17 60.17,22.69 60.17,23.96 IC3.6 | 54.71,19.26 52.29,16.85 52.29,15.07 53.05,14.31 53.05,12.79 D6.A | C1.+ 60.67,37.68 60.17,37.68 R1.1 52.04,32.35 45.18,32.35 45.05,32.22 | X1.6 7.59,34.89 15.21,42.51 15.21,47.08 17.24,49.11 28.16,49.11 45.05,32.22 | 45.05,32.22 45.18,32.09 45.18,29.04 | 45.18,29.04 45.18,27.77 L2.1 45.18,29.04 | 45.18,29.04 52.8,21.42 52.8,21.17 54.71,19.26

### Text on the board
Top: TOP
Bottom: BOT
tNames: www.freebus.org | GND | Ctrl AVR, Rev. 3.02
Case: Freebus | Binäreingang, 8x230 V
Drill_legend: Bohrlegende | Datum: 10.04.2010 16:02:12 | 2.8000 mm / 110.236 mil | 1.6000 mm / 62.992 mil | 1.4000 mm / 55.118 mil | 1.1000 mm / 43.307 mil | 1.0000 mm / 39.370 mil | 0.9000 mm / 35.433 mil | 0.8000 mm / 31.496 mil